# Altium schematic sheet Connectors.SchDoc
size A4; SheetNumber: 5; SheetTotal: 6
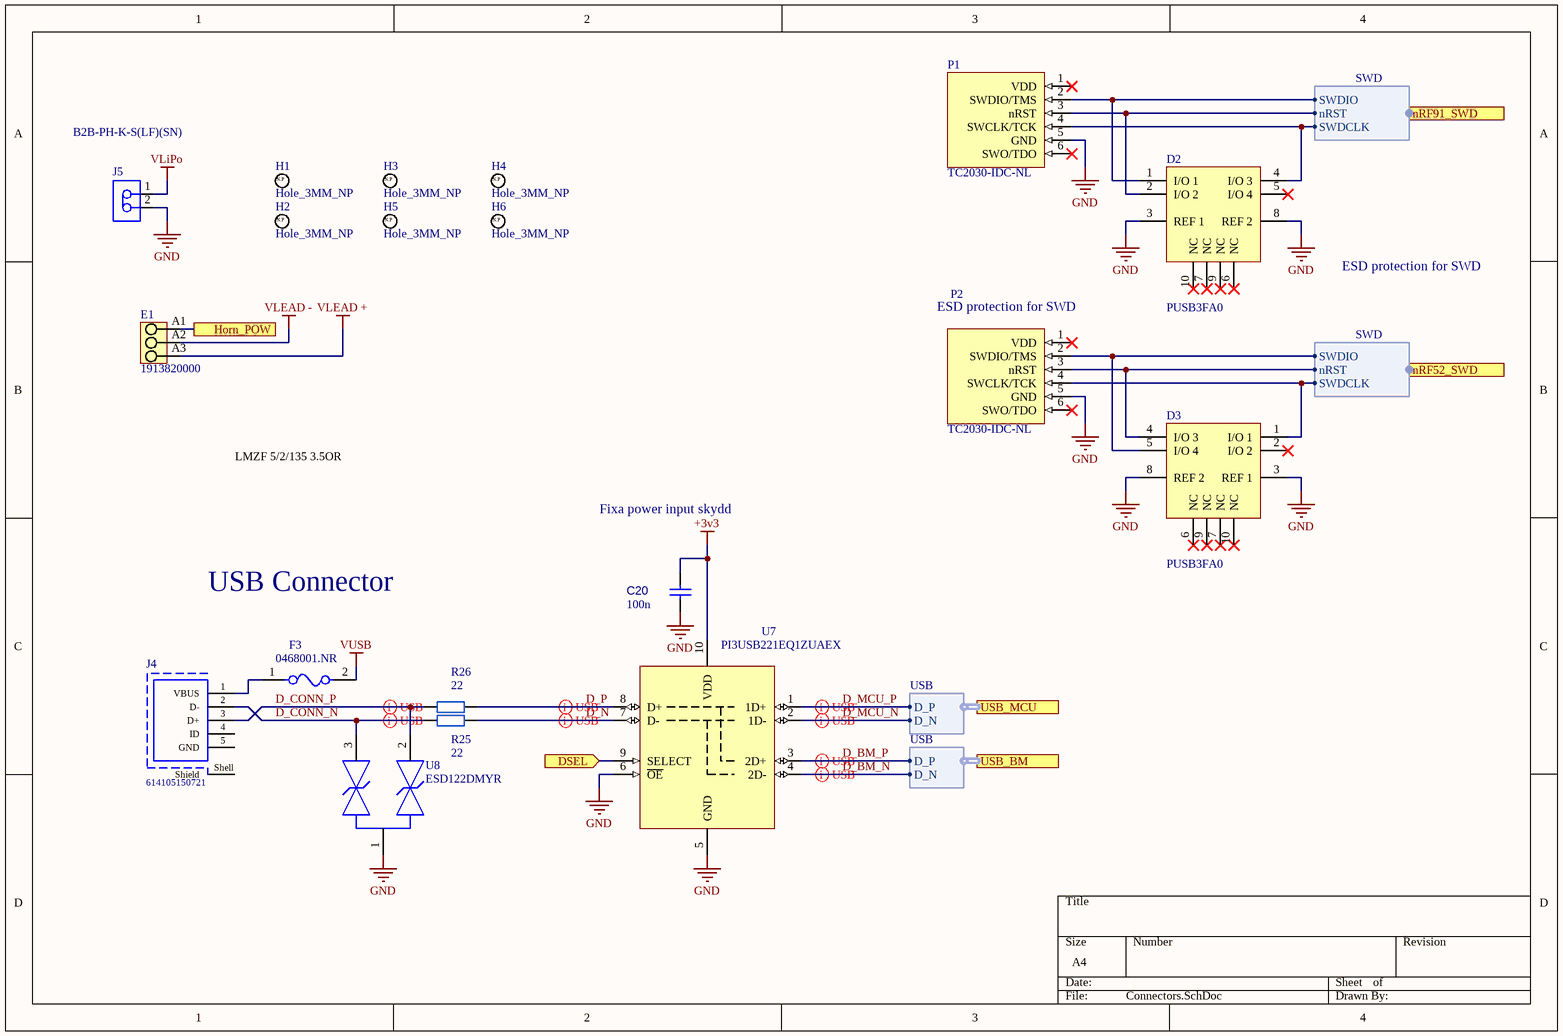
[diagram p0: Connectors.SchDoc]

## Parts
C20  value 100n  [CAPC1005X55X25LL05T10 HD]  (hidden comment: Capacitor 0402)
D2  PUSB3FA0  [FP-SOT1176-1-MFG]
D3  PUSB3FA0  [FP-SOT1176-1-MFG]
E1  1913820000  [LMZF_5_135_03]
F3  0468001.NR  [FP-0468-MFG]
H1  Hole_3MM_NP  [Hole_3MM_NP-Footprint-1]  (no BOM)
H2  Hole_3MM_NP  [Hole_3MM_NP-Footprint-1]  (no BOM)
H3  Hole_3MM_NP  [Hole_3MM_NP-Footprint-1]  (no BOM)
H4  Hole_3MM_NP  [Hole_3MM_NP-Footprint-1]  (no BOM)
H5  Hole_3MM_NP  [Hole_3MM_NP-Footprint-1]  (no BOM)
H6  Hole_3MM_NP  [Hole_3MM_NP-Footprint-1]  (no BOM)
J4  614105150721  [614105150721]
J5  B2B-PH-K-S(LF)(SN)  [JST-B2B-PH-K-S_V]
P1  TC2030-IDC-NL  [New footprint 1]
P2  TC2030-IDC-NL  [New footprint 1]
R25  value 22  [RESC1005X40X25LL10T10 HD]  (hidden comment: Resistor 0403)
R26  value 22  [RESC1005X40X25LL10T10 HD]  (hidden comment: Resistor 0403)
U7  PI3USB221EQ1ZUAEX  [PI3USB221EQ1ZUAEX-Footprint-1]
U8  ESD122DMYR  [FP-DMY0003A-MFG]

## Ports
DSEL (in), Horn_POW, nRF52_SWD (harness SWD), nRF91_SWD (harness SWD), USB_BM (harness USB), USB_MCU (harness USB)

## Harnesses
SWD: SWDIO, SWDCLK, nRST
USB: D_P, D_N

## Nets
+3v3: C20.2 U7.10(VDD)
GND: C20.1 D2.3(REF_1) D2.8(REF_2) D3.3(REF_1) D3.8(REF_2) J5.2 P1.5(GND) P2.5(GND) U7.5(GND) U7.6(~{OE}) U8.1(GND)
VLEAD +: E1.A3
VLEAD -: E1.A2
VLiPo: J5.1
VUSB: F3.2
D_BM_N: U7.4(2D-) ; port USB_BM.D_N
D_BM_P: U7.3(2D+) ; port USB_BM.D_P
D_CONN_N: J4.2(D-) R25.1 U8.3(IO2)
D_CONN_P: J4.3(D+) R26.1 U8.2(IO1)
D_MCU_N: U7.2(1D-) ; port USB_MCU.D_N
D_MCU_P: U7.1(1D+) ; port USB_MCU.D_P
D_N: R25.2 U7.7(D-)
D_P: R26.2 U7.8(D+)
DSEL: U7.9(SELECT) ; port DSEL
Horn_POW: E1.A1 ; port Horn_POW
NetD2_1: D2.1(I/O_1) P1.2(SWDIO/TMS) ; port nRF91_SWD.SWDIO
NetD2_2: D2.2(I/O_2) P1.3(nRST) ; port nRF91_SWD.nRST
NetD2_4: D2.4(I/O_3) P1.4(SWCLK/TCK) ; port nRF91_SWD.SWDCLK
NetD3_1: D3.1(I/O_1) P2.4(SWCLK/TCK) ; port nRF52_SWD.SWDCLK
NetD3_4: D3.4(I/O_3) P2.3(nRST) ; port nRF52_SWD.nRST
NetD3_5: D3.5(I/O_4) P2.2(SWDIO/TMS) ; port nRF52_SWD.SWDIO
NetF3_1: F3.1 J4.1(VBUS)

Not connected (* = marked no-connect by the designer): D2 5(I/O_4)* 6(NC)* 7(NC)* 9(NC)* 10(NC)*; D3 2(I/O_2)* 6(NC)* 7(NC)* 9(NC)* 10(NC)*; H1 1; H2 1; H3 1; H4 1; H5 1; H6 1; J4 4(ID) 5(GND) Shell(Shield); P1 1(VDD)* 6(SWO/TDO)*; P2 1(VDD)* 6(SWO/TDO)*

## Layout directives
differential pair; differential pair class USB; net class USB: D_BM_N, D_BM_P, D_CONN_N, D_CONN_P, D_MCU_N, D_MCU_P, D_N, D_P

## Notes on the sheet
- (near P2) ESD protection for SWD
- ESD protection for SWD
- LMZF 5/2/135 3.5OR
- Fixa power input skydd
- USB Connector
- (in symbol CMP-022-000001-2) N.P

## Library data of the parts
C20 = CMP-001-00008-10: Chip Capacitor, 0402 (1005 Metric); Tolerance: ?%; Capacitor Type: Ceramic; Voltage Rating: ?V; Case/Package: 0402; Pins: 2; Mounting Technology: SMT
D2 D3 = CMP-001-0001-2: ESD protection for ultra high-speed interfaces; ComponentLink1Description: Datasheet; ComponentLink1URL: https://assets.nexperia.com/documents/data-sheet/PUSB3FA0.pdf
E1 = CMP-1559-01899-1: OMNIMATE Signal - series LMZF; Manufacturer: Weidmueller; Insulating_material: Wemid (PA); No_of_poles: 3; Contact_surface: tinned; Contact_material: E-Cu; Solid_min_H05_07_V_U: 0,13 mm²; Solid_max_H05_07_V_U: 2,5 mm²; Wire_cross_section_AWG_min_UL_1059: AWG 26; Pitch_inch: 0,197 inch; Wire_cross_section_AWG_max_UL_1059: AWG 14; Short_text_for_material: LMZF 5/3/135 3.5OR; UL_94_flammability_rating: V-0; Rated_current_use_group_B_UL_1059: 15 A; Rated_voltage_use_group_B_UL_1059: 300 V; Side_termination_characteristic: closed side; Pitch_mm: 5 mm; Rated_voltage_for_surge_voltage_class_pollution_degree_II_2: 630 V; Solder_pin_length_mm: 3,5 mm; Mounting_onto_the_PCB: Solder connection; ComponentLink2URL: http://catalog.weidmueller.com/catalog/Start.do?localeId=en&ObjectID=1913820000; Colour: Orange; Revision: V1; Qty: 100 PCS; Packaging: Box; PackageReference: LMZF_5_135_03; ComponentLink1Description: Manufacturer URL; PartNumber: 1913820000; ComponentLink1URL: http://www.weidmueller.com/; ComponentLink2Description: URL Link1
F3 = CMP-2000-05753-2: FUSE BOARD MNT 1A 63VAC/VDC 1206; Manufacturer: Littelfuse; Fuse Interrupt Dc Current: 50A; Fuse I2T: 0.127A2Sec; Max Fuse Ac Voltage: 63V; Fuse Blow Speed: Slow; Resistance: 0.079Ω; Value: 0.079Ω; Fuse Voltage Drop: 94.7mV; Temperature: -55°C to +90°C; Automotive: No; Height: 0.762mm; Octopart: https://octopart.com/0468001.nr-littelfuse-566477; Device Class L1: Circuit Protection; Digikey Description: FUSE BOARD MNT 1A 63VAC/VDC 1206; ComponentLink2Description: Datasheet; Temperature Range Low: -55°C; Mouser Description: Surface Mount Fuses 1A Slo-Blo; Fuse Interrupt Ac Current: 50A; Max Fuse Dc Voltage: 63V; Fuse Current: 1A; RoHS: TRUE; Temperature Range High: +90°C; Category: Fuse; ComponentLink2URL: https://m.littelfuse.com/~/media/electronics/datasheets/fuses/littelfuse_fuse_468_datasheet.pdf.pdf; Package: 0468; Device Class L3: unset; Voltage Rating: 63V; Device Class L2: Fuses; Manufacturer Part Number: 0468001.NR; Lead Free: Yes
H1-H6 = CMP-022-000001-2: Regular Non-Plated, 3mm hole; Part number IPS: N.A.; Manufacturer: Nordic Semiconductor; Value: 3mm,N.P; Pad Count: 1; Design Item ID: Hole_3MM_NP; Part Number: Hole_3MM_NP; Published: 2009-12-12; Manufacturer Part Number: N.A.; ComponentLink2Description: Supplier link; HelpURL: N.A.; PartId: 100500145; Pin Count: 1; Footprint Doc: Hole_3MM_NP; Artikkelnr Noca: N.A.; LatestRevisionDate: 2009-12-12; Component Class: Connectors; ComponentLink1URL: N.A.; Source: pca20035.SCHLIB; ComponentLink1Description: Datasheet; ComponentLink2URL: N.A.; Component Type: Standard (No BOM); Note: Regular Non-Plated, 3mm hole
J4 = CMP-1502-03250-1: Micro USB 2.0 Type B Receptacle WR-COM, Vertical, THT; Manufacturer: Wurth Elektronik; Working Voltage: 30VAC; Contact Resistance: 30mOhm; Rated Current: 1.8A; Orientation: Vertical; Package Reference: 614105150721; Operating Temperature: -40to85degC; Publisher: WurthElektronik; Part Number: 614105150721; Mounting Technology: THT; Manufacturer URL: http://www.we-online.de; Connector Type: MicroUSB2.0TypeB; Packaging: TapeandReel; Gender: Receptacle; Datasheet URL: https://katalog.we-online.de/em/datasheet/614105150721.pdf
J5 = CMP-2000-05162-1: Male Header, Pitch 2 mm, 1 x 2 Position, Height 6 mm, Tail Length 3.4 mm, -25 to 85 degC, RoHS, Bulk; Manufacturer: JST; Pitch: 2mm; Style/Orientation: StraightHeader/Plug; No of Positions: 2; Datasheet Version: Nov-08; Datasheet URL: http://datasheet.octopart.com/B2B-PH-K-S%28LF%29%28SN%29-JST-datasheet-8324864.pdf; Manufacturer URL: http://www.jst.com/home2.html; Type: ShroudedHeader; Termination: Crimp
P1 P2 = CMP-002-00072-1: The TC2030-IDC-NL is our “No Legs” 6-pin Plug-of-Nails™ programming cable fitted with a 6-pin 0.1″ pitch ribbon connector.; ComponentLink1Description: Link; ComponentLink1URL: https://www.tag-connect.com/product/tc2030-idc-nl?fbclid=IwAR1tgnLH4nUig5e5nqm2vOLKgKeHrLJDpX61UscnRNookxhlbYr0vcLwdls
R25 R26 = CMP-009-00178-3: Package: 0403; Design Item ID: Resistor EU; Source: Moto Symbol Lib.SchLib
U7 = CMP-015-00008-3: High-Speed USB2.0 1:2 Multiplexer/DeMultiplexer Switch with Signal Enable; ComponentLink1URL: https://4donline.ihs.com/images/VipMasterIC/IC/DIOD/DIOD-S-A0012930327/DIOD-S-A0012956463-1.pdf?hkey=6D3A4C79FDBF58556ACFDE234799DDF0; ComponentLink1Description: Datasheet
U8 = CMP-04985-000020-1: TVS DIODE 3.6V 8.4V 3X2SON; Min Breakdown Voltage: 5.1V; Number of Bidirectional Channels: 2; Power Line Protection: No; Peak Pulse Current: 2.5A; Interface: USB; Peak Pulse Power: 20W; Packaging: Tape and Reel; Clamping Voltage: 8.4V; Number of Pins: 3; Reverse Standoff Voltage: 3.6V; Mount: Surface Mount; Min Operating Temperature: -40°C; Number of Channels: 2; RoHS Compliant: Yes; Max Operating Temperature: 125°C; Resistor Type: Zener